# Altium schematic sheet Power_Distribution_Unit.SchDoc
size A4; SPICEModelCacheQYZFBRLI: <root> / <DocumentId>QYZFBRLI</DocumentId> / </root>
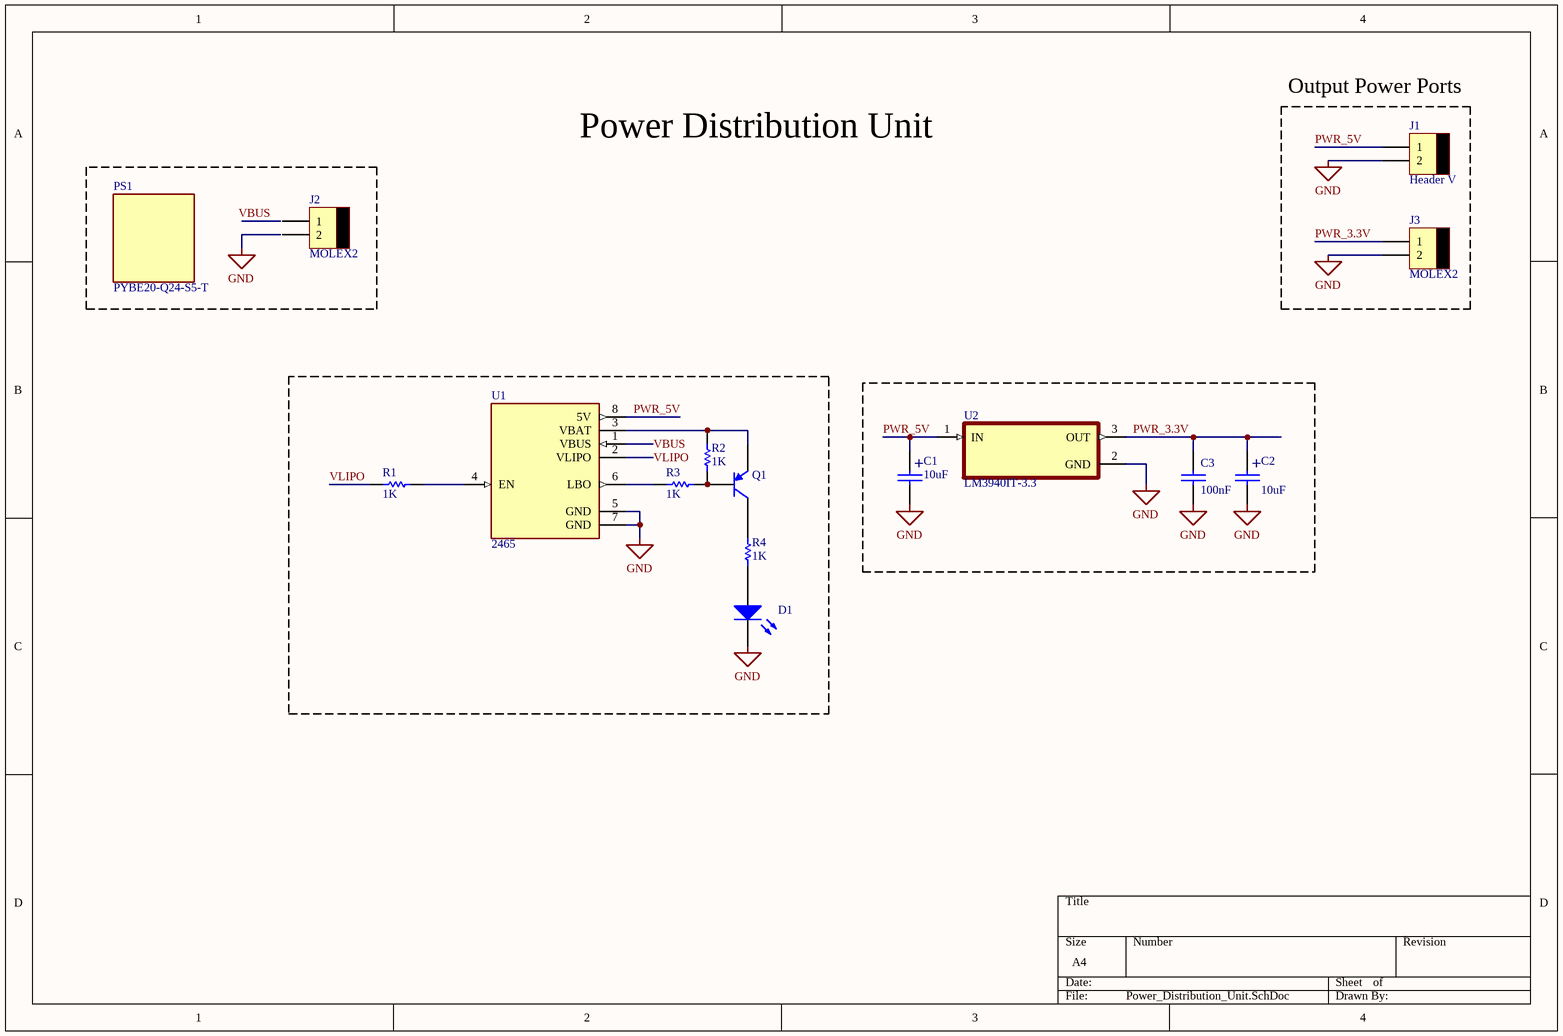
[diagram p0: Power_Distribution_Unit.SchDoc]

## Parts
C1  10uF  [CAP100RP]
C2  10uF  [CAP100RP]
C3  100nF  [CAP200]
D1  Light-Emitting Diode  (value not drawn)
J1  Header V  [MOLEX2]
J2  MOLEX2  [MOLEX2]
J3  MOLEX2  [MOLEX2]
PS1  PYBE20-Q24-S5-T  [PYBE20-Q24-S5-T]
Q1  Bipolar PNP 3 Pins Transistor Gummel-Poon Model  (value not drawn)
R1  value 1K  (hidden comment: Resistor)
R2  value 1K  (hidden comment: Resistor)
R3  value 1K  (hidden comment: Resistor)
R4  value 1K  (hidden comment: Resistor)
U1  2465  [MODULE_2465]
U2  LM3940IT-3.3  [TO254P1054X470X1955-3]

## Blocks framed on the sheet
Output Power Ports: J1 J3

## Nets
GND: C1.2 C2.2 C3.2 D1.2(K) J1.2 J3.2 U1.5(GND) U1.7(GND) U2.2(GND)
PWR_3.3V: C2.1 C3.1 J3.1 U2.3(OUT)
PWR_5V: C1.1 J1.1 U1.8(5V) U2.1(IN)
VBUS: U1.1(VBUS)
VLIPO: R1.2 U1.2(VLIPO)
NetD1_1: D1.1(A) R4.1
NetQ1_1: Q1.1(C) R4.2
NetQ1_2: Q1.2(B) R2.1 R3.1
NetQ1_3: Q1.3(E) R2.2 U1.3(VBAT)
NetR1_1: R1.1 U1.4(EN)
NetR3_2: R3.2 U1.6(LBO)

Not connected (* = marked no-connect by the designer): J2 1 2

## Notes on the sheet
- Power Distribution Unit
- (in symbol CAPPOL) +

## Library data of the parts
C1 C2 = CAPPOL
C3 = CAP
D1 = LED: AF: 1; BV: 0; BV_MAX: 1e99; EG: 1.11; FC: 0.5; IBV: 0.001; IS: 1e-14; MJSW: 0.33; NTUN: 30; TNOM: 27; XTI: 3; SimulationGenericComponent: True; CJO: 0; CJP: 0; CTA: 0; CTP: 0; FCS: 0.5; FV_MAX: 1e99; IKF: 0; IKR: 0; ISR: 1e-14; JSW: 0; JTUN: 0; JTUNSW: 0; KEG: 1; KF: 0; LEVEL: 1; N: 1; NBV: 1; NR: 1; NS: 1; PHP: 1; RS: 0; TCV: 0; TLEV: 0; TLEVC: 0; TM1: 0; TM2: 0; TPB: 0; TPHP: 0; TRS: 0; TRS2: 0; TT: 0; TTT1: 0; TTT2: 0; VJ: 1; XTITUN: 3
J1 = MOLEX2
PS1 = PYBE20-Q24-S5-T: DC-DC Converters
Q1 = BJT PNP GP: BF: 100; AF: 0; BR: 1; EG: 1.11; FC: 0.5; IS: 1e-16; MJC: 0.33; NC: 2; NE: 1.5; TNOM: 27; VBC_MAX: 1e99; VJC: 0.75; XTI: 3; SimulationGenericComponent: True; CJC: 0; CJE: 0; CJS: 0; CTC: 0; CTE: 0; CTS: 0; IKF: 0; IKR: 0; IRB: 0; ISC: 0; ISE: 0; ISS: 0; ITF: 0; KF: 0; MJE: 0.33; MJS: 0; NF: 1; NKF: 0.5; NR: 1; NS: 1; PTF: 0; RB: 0; RBM: 0; RC: 0; RE: 0; SUBS: 1; TBF1: 0; TBF2: 0; TBR1: 0; TBR2: 0; TF: 0; TIKF1: 0; TIKF2: 0; TIKR1: 0; TIKR2: 0; TIRB1: 0; TIRB2: 0; TIS1: 0; TIS2: 0; TISC1: 0; TISC2: 0; TISE1: 0; TISE2: 0; TITF1: 0; TITF2: 0; TLEV: 0; TLEVC: 0; TMJC1: 0; TMJC2: 0; TMJE1: 0; TMJE2: 0; TMJS1: 0; TMJS2: 0; TNC1: 0; TNC2: 0; TNE1: 0; TNE2: 0; TNF1: 0; TNF2: 0; TNR1: 0; TNR2: 0; TNS1: 0; TNS2: 0; TR: 0; TRB1: 0; TRB2: 0; TRC1: 0; TRC2: 0; TRE1: 0; TRE2: 0; TRM1: 0; TRM2: 0; TTF1: 0; TTF2: 0; TTR1: 0; TTR2: 0; TVAF1: 0; TVAF2: 0; TVAR1: 0; TVAR2: 0; TVJC: 0; TVJE: 0; TVJS: 0; VAF: 0; VAR: 0; VBE_MAX: 1e99; VCE_MAX: 1e99; VJE: 0.75; VJS: 0.75; VTF: 0; XCJC: 1; XTB: 0; XTF: 0
R1-R4 = Resistor: TC1: 0; SimulationGenericComponent: True; TC2: 0
U1 = CMP-025-000000-1: PowerBoost 1000 Charger - Rechargeable 5V Lipo USB Boost at 1A - 1000C; MF: Adafruit Industries; Value: *; Design Item ID: 2465; Source: 2465.SchLib; SnapEDA_Link: https://www.snapeda.com/parts/2465/Adafruit+Industries+LLC/view-part/?ref=snap; Package: None; MP: 2465; Price: None; Check_prices: https://www.snapeda.com/parts/2465/Adafruit+Industries+LLC/view-part/?ref=eda; Pin Count: 8; Availability: In Stock; Component Type: Standard
U2 = CMP-009-000002-1: 1A Low Dropout Regulator for 5V to 3.3V Conversion; MF: Texas Instruments; MP: LM3940IT-3.3/NOPB; Value: *; Price: None; Package: TO-220-3 Texas Instruments; SnapEDA_Link: https://www.snapeda.com/parts/LM3940IT-3.3/NOPB/Texas%20Instruments/view-part/50719/?ref=snap; Arrow_Electronics-Purchase-URL: https://snapeda.com/shop?store=Arrow+Electronics&id=50719; Availability: Unavailable; Texas_Instruments-Purchase-URL: https://snapeda.com/shop?store=Texas+Instruments&id=50719; Design Item ID: LM3940IT-3.3; DigiKey-Purchase-URL: https://snapeda.com/shop?store=DigiKey&id=50719; Source: LM3940IT-3.3.SchLib; Component Type: Standard; Pin Count: 3; Mouser-Purchase-URL: https://snapeda.com/shop?store=Mouser&id=50719